# Altium schematic sheet VoltageRegulator.SchDoc
size A4; SheetNumber: 2; SheetTotal: 2
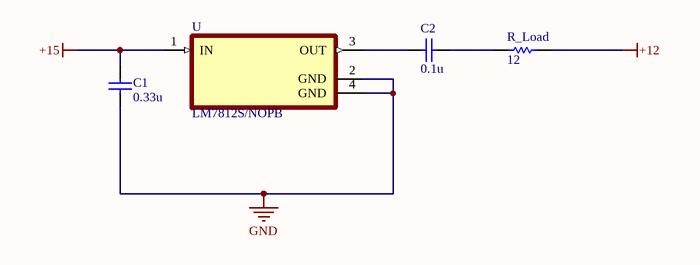
[diagram p0: VoltageRegulator.SchDoc]

## Parts
C1  value 0.33u  (hidden comment: Capacitor)
C2  value 0.1u  (hidden comment: Capacitor)
R_Load  value 12  (hidden comment: Resistor)
U  LM7812S/NOPB  [TO254P1524X483-4N]

## Nets
+12: R_Load.2
+15: C1.2 U.1(IN)
GND: C1.1 U.2(GND) U.4(GND)
NetC2_1: C2.1 U.3(OUT)
NetC2_2: C2.2 R_Load.1

## Library data of the parts
C1 C2 = Capacitor: SimulationGenericComponent: True
R_Load = Resistor: TC1: 0; SimulationGenericComponent: True; TC2: 0
U = LM7812S/NOPB: 1.5-A, 30-V, linear voltage regulator 3-DDPAK/TO-263 0 to 125; MF: Texas Instruments; Mouser-Purchase-URL: https://snapeda.com/shop?store=Mouser&id=559615; Value: *; Arrow_Electronics-Purchase-URL: https://snapeda.com/shop?store=Arrow+Electronics&id=559615; Price: None; Availability: Unavailable; DigiKey-Purchase-URL: https://snapeda.com/shop?store=DigiKey&id=559615; Texas_Instruments-Purchase-URL: https://snapeda.com/shop?store=Texas+Instruments&id=559615; SnapEDA_Link: https://www.snapeda.com/parts/LM7812S/NOPB/Texas%20Instruments/view-part/559615/?ref=snap; Package: TO-263-3 Texas Instruments; MP: LM7812S/NOPB